# Altium schematic sheet PicoPrint-Motors.SchDoc
size A2; DocumentNumber: 4; SheetNumber: 4; SheetTotal: 5
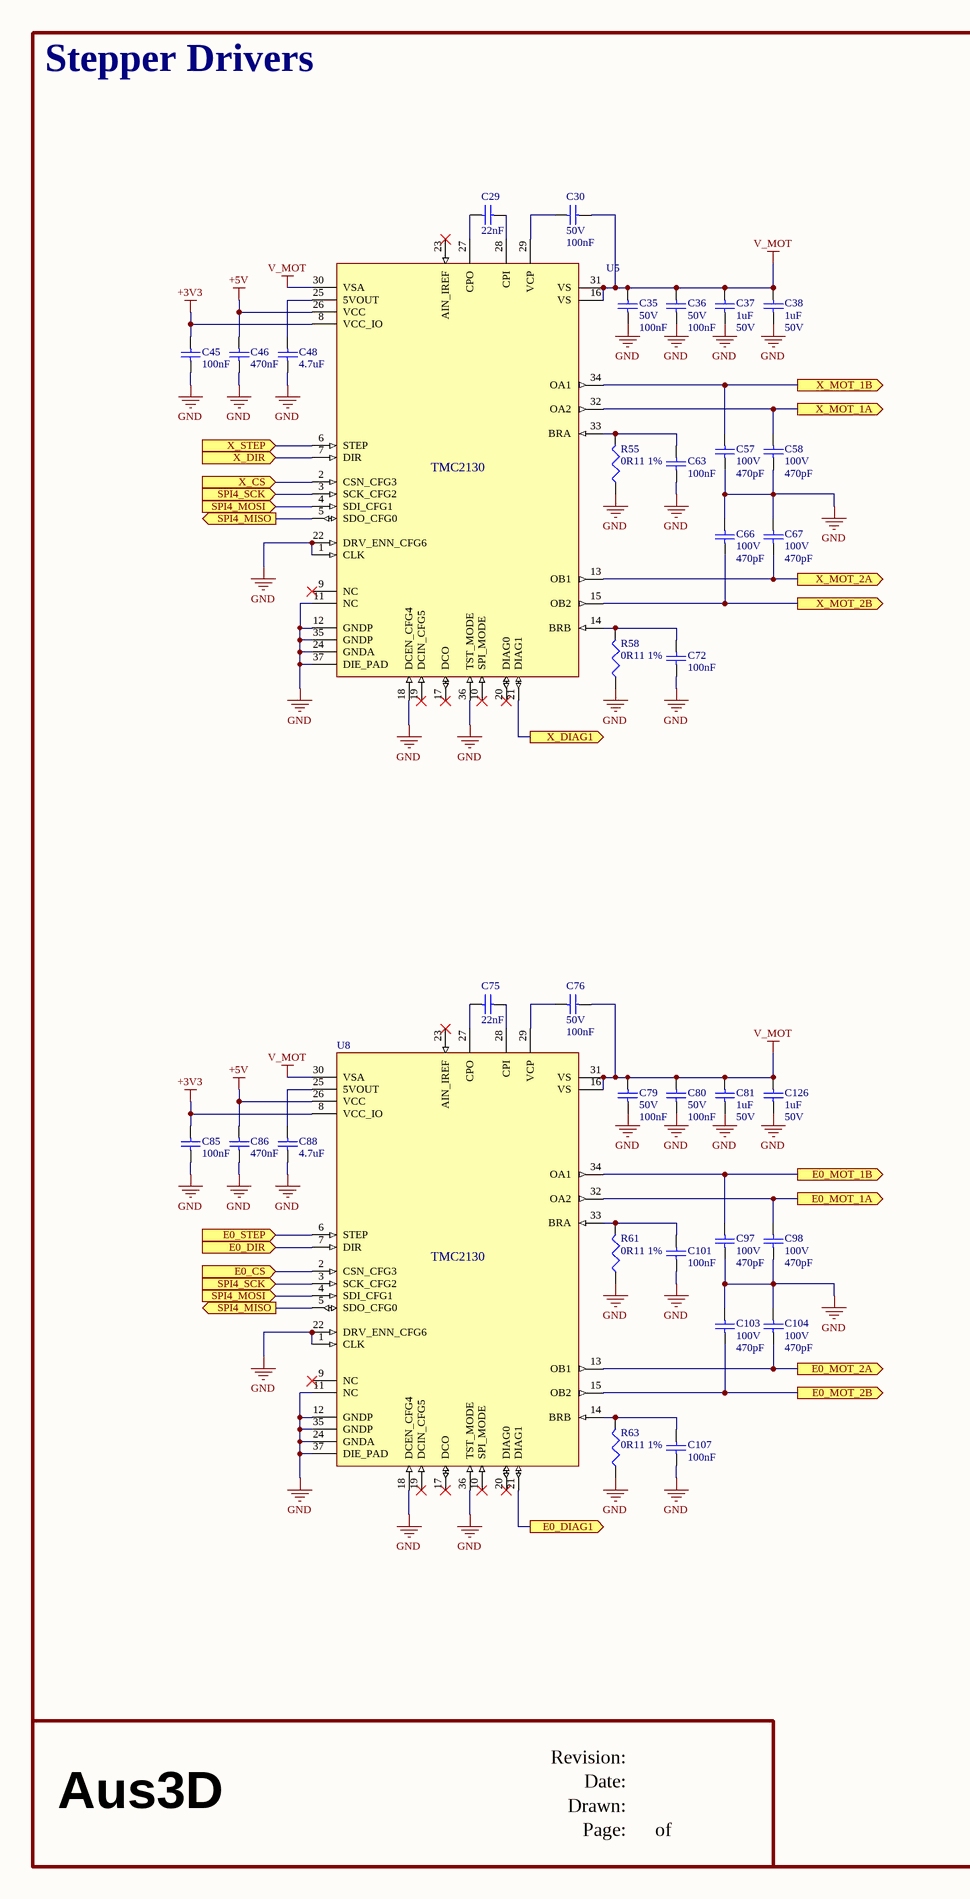
[diagram p0: PicoPrint-Motors.SchDoc, left]
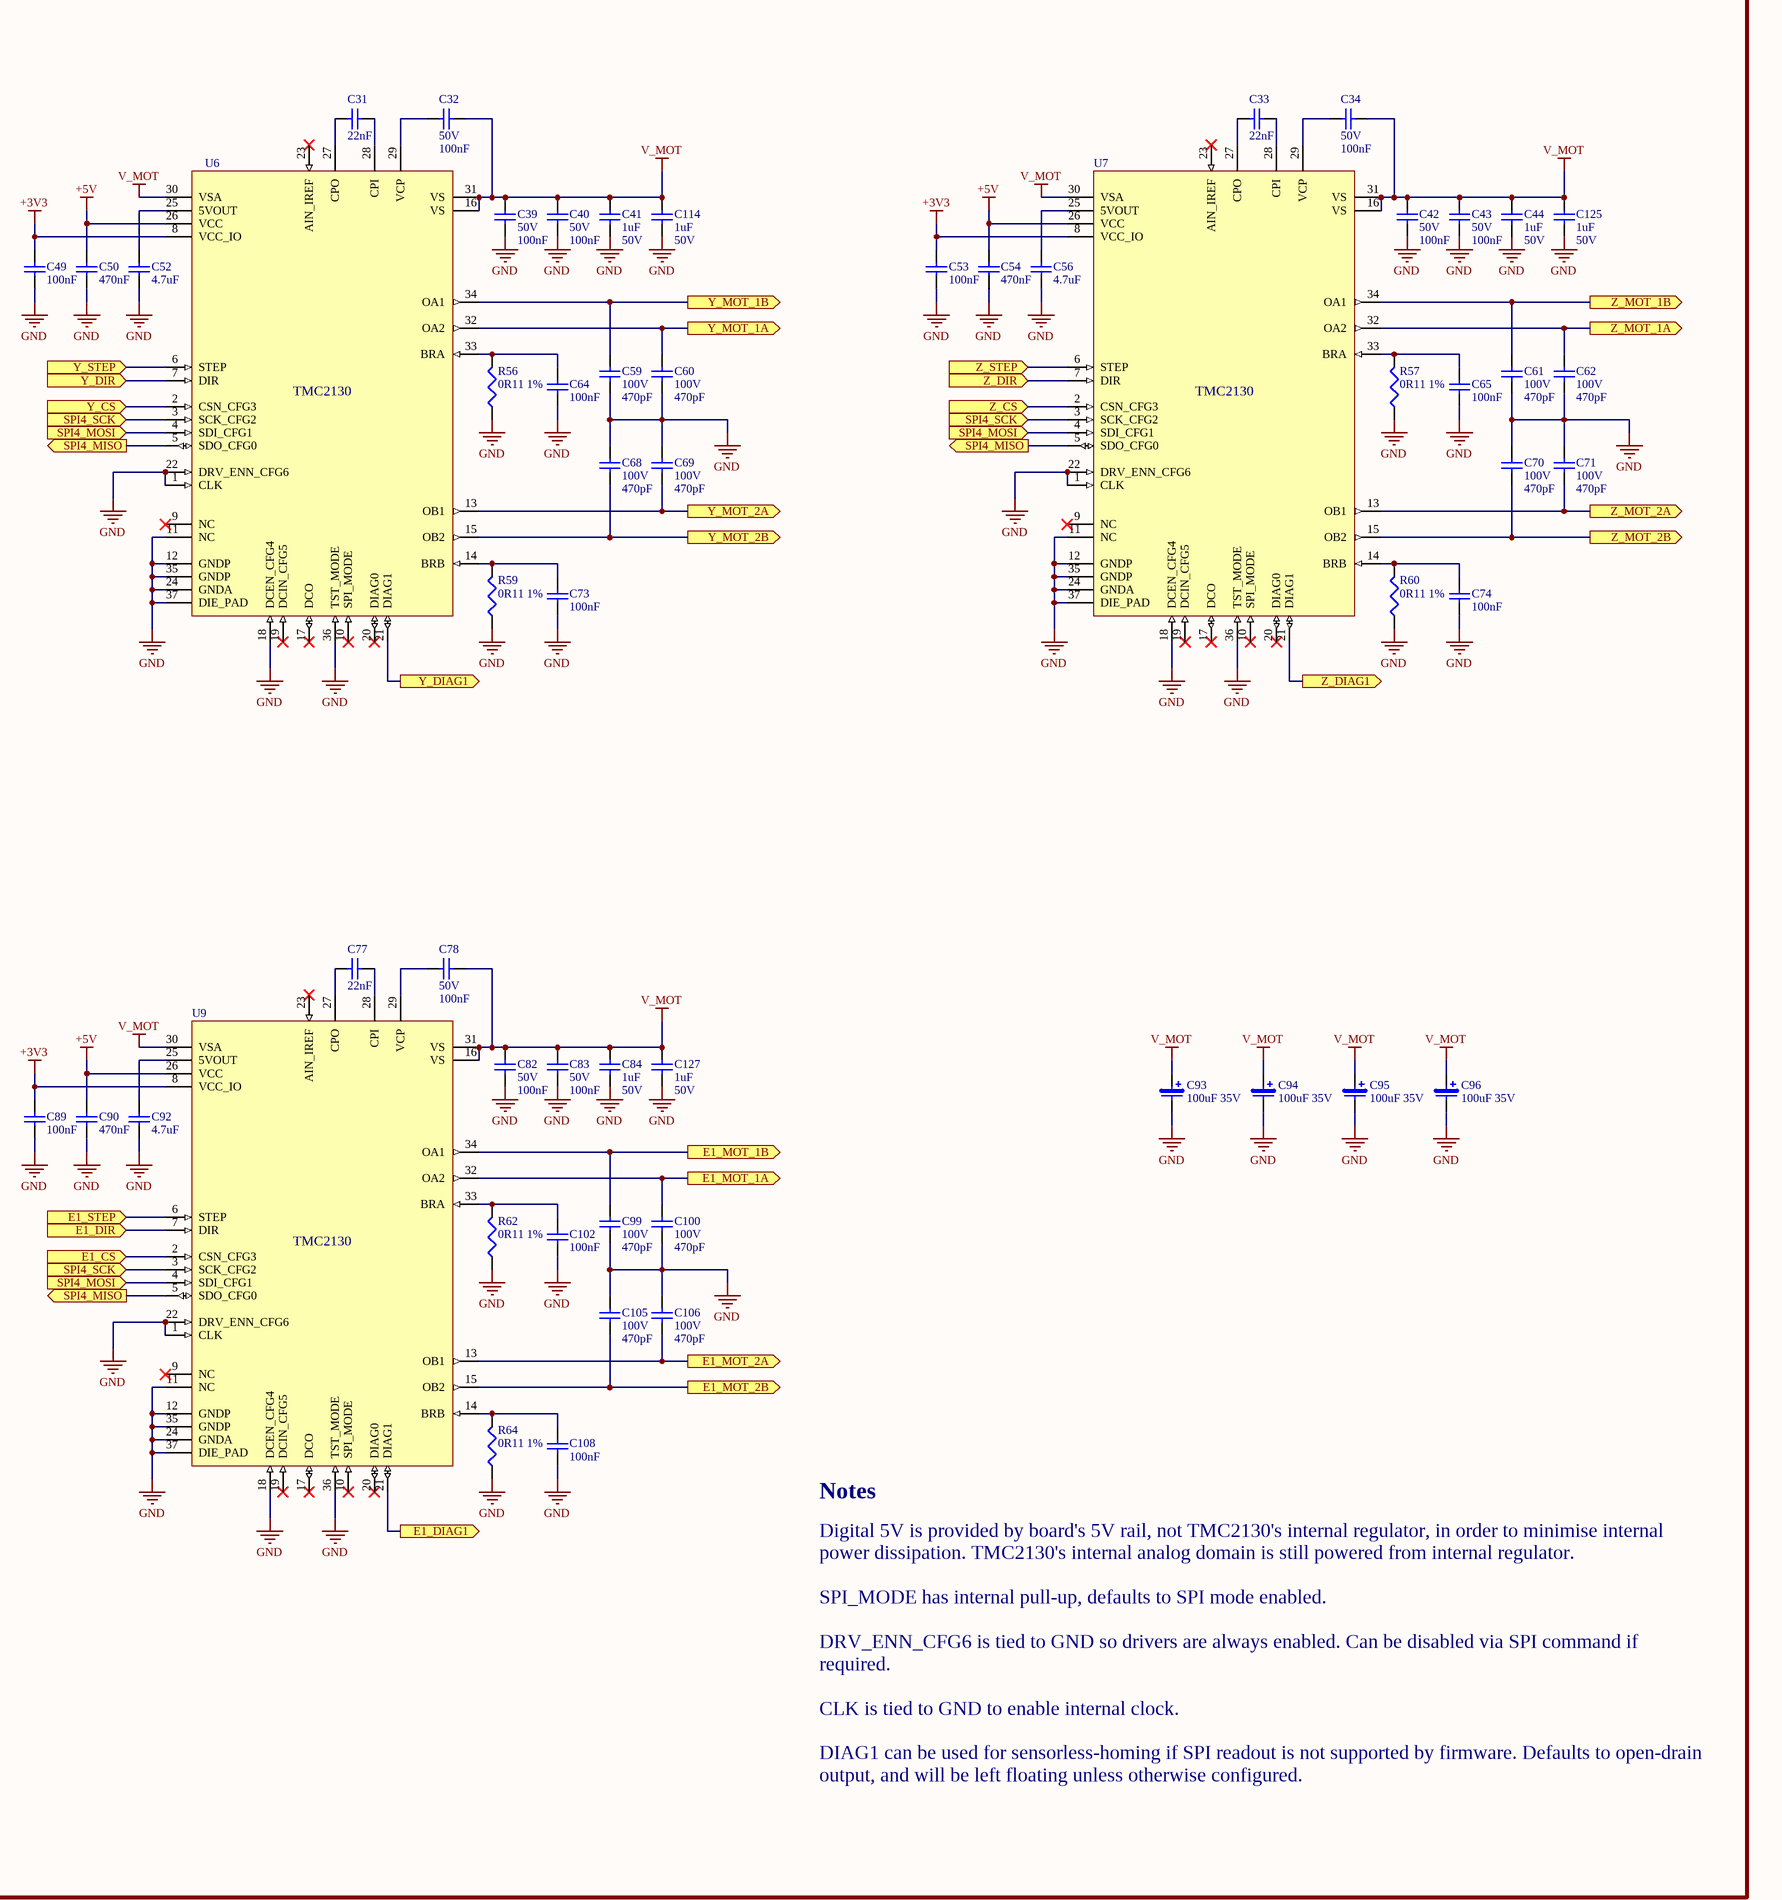
[diagram p1: PicoPrint-Motors.SchDoc, right]

## Parts
C29  value 22nF  [CAP 1005-0402]  (hidden comment: CapC-0402-22nF-50V)
C30  value 100nF  Voltage: 50V  [CAP 1005-0402]  (hidden comment: CapC-0402-100nF-50V)
C31  value 22nF  [CAP 1005-0402]  (hidden comment: CapC-0402-22nF-50V)
C32  value 100nF  Voltage: 50V  [CAP 1005-0402]  (hidden comment: CapC-0402-100nF-50V)
C33  value 22nF  [CAP 1005-0402]  (hidden comment: CapC-0402-22nF-50V)
C34  value 100nF  Voltage: 50V  [CAP 1005-0402]  (hidden comment: CapC-0402-100nF-50V)
C35  value 100nF  Voltage: 50V  [CAP 1005-0402]  (hidden comment: CapC-0402-100nF-50V)
C36  value 100nF  Voltage: 50V  [CAP 1005-0402]  (hidden comment: CapC-0402-100nF-50V)
C37  value 1uF  Voltage: 50V  [Cap 1608-0603]  (hidden comment: CapC-0603-1uF 50V)
C38  value 1uF  Voltage: 50V  [Cap 1608-0603]  (hidden comment: CapC-0603-1uF 50V)
C39  value 100nF  Voltage: 50V  [CAP 1005-0402]  (hidden comment: CapC-0402-100nF-50V)
C40  value 100nF  Voltage: 50V  [CAP 1005-0402]  (hidden comment: CapC-0402-100nF-50V)
C41  value 1uF  Voltage: 50V  [Cap 1608-0603]  (hidden comment: CapC-0603-1uF 50V)
C42  value 100nF  Voltage: 50V  [CAP 1005-0402]  (hidden comment: CapC-0402-100nF-50V)
C43  value 100nF  Voltage: 50V  [CAP 1005-0402]  (hidden comment: CapC-0402-100nF-50V)
C44  value 1uF  Voltage: 50V  [Cap 1608-0603]  (hidden comment: CapC-0603-1uF 50V)
C45  value 100nF  [CAP 1005-0402]  (hidden comment: CapC-0402-100nF)
C46  value 470nF  [CAP 1005-0402]  (hidden comment: CapC-0402-470nF)
C48  value 4.7uF  [CAP 1005-0402]  (hidden comment: CapC-0402-4.7uF-10V)
C49  value 100nF  [CAP 1005-0402]  (hidden comment: CapC-0402-100nF)
C50  value 470nF  [CAP 1005-0402]  (hidden comment: CapC-0402-470nF)
C52  value 4.7uF  [CAP 1005-0402]  (hidden comment: CapC-0402-4.7uF-10V)
C53  value 100nF  [CAP 1005-0402]  (hidden comment: CapC-0402-100nF)
C54  value 470nF  [CAP 1005-0402]  (hidden comment: CapC-0402-470nF)
C56  value 4.7uF  [CAP 1005-0402]  (hidden comment: CapC-0402-4.7uF-10V)
C57  value 470pF  Voltage: 100V  [CAP 1005-0402]  (hidden comment: CapC-0402-470pF-100V)
C58  value 470pF  Voltage: 100V  [CAP 1005-0402]  (hidden comment: CapC-0402-470pF-100V)
C59  value 470pF  Voltage: 100V  [CAP 1005-0402]  (hidden comment: CapC-0402-470pF-100V)
C60  value 470pF  Voltage: 100V  [CAP 1005-0402]  (hidden comment: CapC-0402-470pF-100V)
C61  value 470pF  Voltage: 100V  [CAP 1005-0402]  (hidden comment: CapC-0402-470pF-100V)
C62  value 470pF  Voltage: 100V  [CAP 1005-0402]  (hidden comment: CapC-0402-470pF-100V)
C63  value 100nF  [CAP 1005-0402]  (hidden comment: CapC-0402-100nF)
C64  value 100nF  [CAP 1005-0402]  (hidden comment: CapC-0402-100nF)
C65  value 100nF  [CAP 1005-0402]  (hidden comment: CapC-0402-100nF)
C66  value 470pF  Voltage: 100V  [CAP 1005-0402]  (hidden comment: CapC-0402-470pF-100V)
C67  value 470pF  Voltage: 100V  [CAP 1005-0402]  (hidden comment: CapC-0402-470pF-100V)
C68  value 470pF  Voltage: 100V  [CAP 1005-0402]  (hidden comment: CapC-0402-470pF-100V)
C69  value 470pF  Voltage: 100V  [CAP 1005-0402]  (hidden comment: CapC-0402-470pF-100V)
C70  value 470pF  Voltage: 100V  [CAP 1005-0402]  (hidden comment: CapC-0402-470pF-100V)
C71  value 470pF  Voltage: 100V  [CAP 1005-0402]  (hidden comment: CapC-0402-470pF-100V)
C72  value 100nF  [CAP 1005-0402]  (hidden comment: CapC-0402-100nF)
C73  value 100nF  [CAP 1005-0402]  (hidden comment: CapC-0402-100nF)
C74  value 100nF  [CAP 1005-0402]  (hidden comment: CapC-0402-100nF)
C75  value 22nF  [CAP 1005-0402]  (hidden comment: CapC-0402-22nF-50V)
C76  value 100nF  Voltage: 50V  [CAP 1005-0402]  (hidden comment: CapC-0402-100nF-50V)
C77  value 22nF  [CAP 1005-0402]  (hidden comment: CapC-0402-22nF-50V)
C78  value 100nF  Voltage: 50V  [CAP 1005-0402]  (hidden comment: CapC-0402-100nF-50V)
C79  value 100nF  Voltage: 50V  [CAP 1005-0402]  (hidden comment: CapC-0402-100nF-50V)
C80  value 100nF  Voltage: 50V  [CAP 1005-0402]  (hidden comment: CapC-0402-100nF-50V)
C81  value 1uF  Voltage: 50V  [Cap 1608-0603]  (hidden comment: CapC-0603-1uF 50V)
C82  value 100nF  Voltage: 50V  [CAP 1005-0402]  (hidden comment: CapC-0402-100nF-50V)
C83  value 100nF  Voltage: 50V  [CAP 1005-0402]  (hidden comment: CapC-0402-100nF-50V)
C84  value 1uF  Voltage: 50V  [Cap 1608-0603]  (hidden comment: CapC-0603-1uF 50V)
C85  value 100nF  [CAP 1005-0402]  (hidden comment: CapC-0402-100nF)
C86  value 470nF  [CAP 1005-0402]  (hidden comment: CapC-0402-470nF)
C88  value 4.7uF  [CAP 1005-0402]  (hidden comment: CapC-0402-4.7uF-10V)
C89  value 100nF  [CAP 1005-0402]  (hidden comment: CapC-0402-100nF)
C90  value 470nF  [CAP 1005-0402]  (hidden comment: CapC-0402-470nF)
C92  value 4.7uF  [CAP 1005-0402]  (hidden comment: CapC-0402-4.7uF-10V)
C93  value 100uF 35V  [CAP EL PANASONIC]  (hidden comment: CapE-6.3-100uF-35V)
C94  value 100uF 35V  [CAP EL PANASONIC]  (hidden comment: CapE-6.3-100uF-35V)
C95  value 100uF 35V  [CAP EL PANASONIC]  (hidden comment: CapE-6.3-100uF-35V)
C96  value 100uF 35V  [CAP EL PANASONIC]  (hidden comment: CapE-6.3-100uF-35V)
C97  value 470pF  Voltage: 100V  [CAP 1005-0402]  (hidden comment: CapC-0402-470pF-100V)
C98  value 470pF  Voltage: 100V  [CAP 1005-0402]  (hidden comment: CapC-0402-470pF-100V)
C99  value 470pF  Voltage: 100V  [CAP 1005-0402]  (hidden comment: CapC-0402-470pF-100V)
C100  value 470pF  Voltage: 100V  [CAP 1005-0402]  (hidden comment: CapC-0402-470pF-100V)
C101  value 100nF  [CAP 1005-0402]  (hidden comment: CapC-0402-100nF)
C102  value 100nF  [CAP 1005-0402]  (hidden comment: CapC-0402-100nF)
C103  value 470pF  Voltage: 100V  [CAP 1005-0402]  (hidden comment: CapC-0402-470pF-100V)
C104  value 470pF  Voltage: 100V  [CAP 1005-0402]  (hidden comment: CapC-0402-470pF-100V)
C105  value 470pF  Voltage: 100V  [CAP 1005-0402]  (hidden comment: CapC-0402-470pF-100V)
C106  value 470pF  Voltage: 100V  [CAP 1005-0402]  (hidden comment: CapC-0402-470pF-100V)
C107  value 100nF  [CAP 1005-0402]  (hidden comment: CapC-0402-100nF)
C108  value 100nF  [CAP 1005-0402]  (hidden comment: CapC-0402-100nF)
C114  value 1uF  Voltage: 50V  [Cap 1608-0603]  (hidden comment: CapC-0603-1uF 50V)
C125  value 1uF  Voltage: 50V  [Cap 1608-0603]  (hidden comment: CapC-0603-1uF 50V)
C126  value 1uF  Voltage: 50V  [Cap 1608-0603]  (hidden comment: CapC-0603-1uF 50V)
C127  value 1uF  Voltage: 50V  [Cap 1608-0603]  (hidden comment: CapC-0603-1uF 50V)
R55  value 0R11 1%  [Res 2012-0805]  (hidden comment: Res-0805-0R11-0.333W)
R56  value 0R11 1%  [Res 2012-0805]  (hidden comment: Res-0805-0R11-0.333W)
R57  value 0R11 1%  [Res 2012-0805]  (hidden comment: Res-0805-0R11-0.333W)
R58  value 0R11 1%  [Res 2012-0805]  (hidden comment: Res-0805-0R11-0.333W)
R59  value 0R11 1%  [Res 2012-0805]  (hidden comment: Res-0805-0R11-0.333W)
R60  value 0R11 1%  [Res 2012-0805]  (hidden comment: Res-0805-0R11-0.333W)
R61  value 0R11 1%  [Res 2012-0805]  (hidden comment: Res-0805-0R11-0.333W)
R62  value 0R11 1%  [Res 2012-0805]  (hidden comment: Res-0805-0R11-0.333W)
R63  value 0R11 1%  [Res 2012-0805]  (hidden comment: Res-0805-0R11-0.333W)
R64  value 0R11 1%  [Res 2012-0805]  (hidden comment: Res-0805-0R11-0.333W)
U5  TMC2130-LA  [QFN50P500X600X90_HS-37N]  (value not drawn)
U6  TMC2130-LA  [QFN50P500X600X90_HS-37N]  (value not drawn)
U7  TMC2130-LA  [QFN50P500X600X90_HS-37N]  (value not drawn)
U8  TMC2130-LA  [QFN50P500X600X90_HS-37N]  (value not drawn)
U9  TMC2130-LA  [QFN50P500X600X90_HS-37N]  (value not drawn)

## Ports
E0_CS (in), E0_DIAG1 (out), E0_DIR (in), E0_MOT_1A (out), E0_MOT_1B (out), E0_MOT_2A (out), E0_MOT_2B (out), E0_STEP (in), E1_CS (in), E1_DIAG1 (out), E1_DIR (in), E1_MOT_1A (out), E1_MOT_1B (out), E1_MOT_2A (out), E1_MOT_2B (out), E1_STEP (in), SPI4_MISO (out), SPI4_MOSI (in), SPI4_SCK (in), X_CS (in), X_DIAG1 (out), X_DIR (in), X_MOT_1A (out), X_MOT_1B (out), X_MOT_2A (out), X_MOT_2B (out), X_STEP (in), Y_CS (in), Y_DIAG1 (out), Y_DIR (in), Y_MOT_1A (out), Y_MOT_1B (out), Y_MOT_2A (out), Y_MOT_2B (out), Y_STEP (in), Z_CS (in), Z_DIAG1 (out), Z_DIR (in), Z_MOT_1A (out), Z_MOT_1B (out), Z_MOT_2A (out), Z_MOT_2B (out), Z_STEP (in)

## Nets
+3V3: C45.2 C49.2 C53.2 C85.2 C89.2 U5.8(VCC_IO) U6.8(VCC_IO) U7.8(VCC_IO) U8.8(VCC_IO) U9.8(VCC_IO)
+5V: C46.2 C50.2 C54.2 C86.2 C90.2 U5.26(VCC) U6.26(VCC) U7.26(VCC) U8.26(VCC) U9.26(VCC)
GND: C35.2 C36.2 C37.1 C38.1 C39.2 C40.2 C41.1 C42.2 C43.2 C44.1 C45.1 C46.1 C48.1 C49.1 C50.1 C52.1 C53.1 C54.1 C56.1 C57.1 C58.1 C59.1 C60.1 C61.1 C62.1 C63.2 C64.2 C65.2 C66.2 C67.2 C68.2 C69.2 C70.2 C71.2 C72.2 C73.2 C74.2 C79.2 C80.2 C81.1 C82.2 C83.2 C84.1 C85.1 C86.1 C88.1 C89.1 C90.1 C92.1 C93.2 C94.2 C95.2 C96.2 C97.1 C98.1 C99.1 C100.1 C101.2 C102.2 C103.2 C104.2 C105.2 C106.2 C107.2 C108.2 C114.1 C125.1 C126.1 C127.1 R55.1 R56.1 R57.1 R58.1 R59.1 R60.1 R61.1 R62.1 R63.1 R64.1 U5.1(CLK) U5.11(NC) U5.12(GNDP) U5.18(DCEN_CFG4) U5.22(DRV_ENN_CFG6) U5.24(GNDA) U5.35(GNDP) U5.36(TST_MODE) U5.37(DIE_PAD) U6.1(CLK) U6.11(NC) U6.12(GNDP) U6.18(DCEN_CFG4) U6.22(DRV_ENN_CFG6) U6.24(GNDA) U6.35(GNDP) U6.36(TST_MODE) U6.37(DIE_PAD) U7.1(CLK) U7.11(NC) U7.12(GNDP) U7.18(DCEN_CFG4) U7.22(DRV_ENN_CFG6) U7.24(GNDA) U7.35(GNDP) U7.36(TST_MODE) U7.37(DIE_PAD) U8.1(CLK) U8.11(NC) U8.12(GNDP) U8.18(DCEN_CFG4) U8.22(DRV_ENN_CFG6) U8.24(GNDA) U8.35(GNDP) U8.36(TST_MODE) U8.37(DIE_PAD) U9.1(CLK) U9.11(NC) U9.12(GNDP) U9.18(DCEN_CFG4) U9.22(DRV_ENN_CFG6) U9.24(GNDA) U9.35(GNDP) U9.36(TST_MODE) U9.37(DIE_PAD)
V_MOT: C30.1 C32.1 C34.1 C35.1 C36.1 C37.2 C38.2 C39.1 C40.1 C41.2 C42.1 C43.1 C44.2 C76.1 C78.1 C79.1 C80.1 C81.2 C82.1 C83.1 C84.2 C93.1 C94.1 C95.1 C96.1 C114.2 C125.2 C126.2 C127.2 U5.16(VS) U5.30(VSA) U5.31(VS) U6.16(VS) U6.30(VSA) U6.31(VS) U7.16(VS) U7.30(VSA) U7.31(VS) U8.16(VS) U8.30(VSA) U8.31(VS) U9.16(VS) U9.30(VSA) U9.31(VS)
E0_CS: U8.2(CSN_CFG3) ; port E0_CS
E0_DIAG1: U8.21(DIAG1) ; port E0_DIAG1
E0_DIR: U8.7(DIR) ; port E0_DIR
E0_MOT_1A: C98.2 U8.32(OA2) ; port E0_MOT_1A
E0_MOT_1B: C97.2 U8.34(OA1) ; port E0_MOT_1B
E0_MOT_2A: C104.1 U8.13(OB1) ; port E0_MOT_2A
E0_MOT_2B: C103.1 U8.15(OB2) ; port E0_MOT_2B
E0_STEP: U8.6(STEP) ; port E0_STEP
E1_CS: U9.2(CSN_CFG3) ; port E1_CS
E1_DIAG1: U9.21(DIAG1) ; port E1_DIAG1
E1_DIR: U9.7(DIR) ; port E1_DIR
E1_MOT_1A: C100.2 U9.32(OA2) ; port E1_MOT_1A
E1_MOT_1B: C99.2 U9.34(OA1) ; port E1_MOT_1B
E1_MOT_2A: C106.1 U9.13(OB1) ; port E1_MOT_2A
E1_MOT_2B: C105.1 U9.15(OB2) ; port E1_MOT_2B
E1_STEP: U9.6(STEP) ; port E1_STEP
SPI4_MISO: U5.5(SDO_CFG0) U6.5(SDO_CFG0) U7.5(SDO_CFG0) U8.5(SDO_CFG0) U9.5(SDO_CFG0) ; port SPI4_MISO
SPI4_MOSI: U5.4(SDI_CFG1) U6.4(SDI_CFG1) U7.4(SDI_CFG1) U8.4(SDI_CFG1) U9.4(SDI_CFG1) ; port SPI4_MOSI
SPI4_SCK: U5.3(SCK_CFG2) U6.3(SCK_CFG2) U7.3(SCK_CFG2) U8.3(SCK_CFG2) U9.3(SCK_CFG2) ; port SPI4_SCK
X_CS: U5.2(CSN_CFG3) ; port X_CS
X_DIAG1: U5.21(DIAG1) ; port X_DIAG1
X_DIR: U5.7(DIR) ; port X_DIR
X_MOT_1A: C58.2 U5.32(OA2) ; port X_MOT_1A
X_MOT_1B: C57.2 U5.34(OA1) ; port X_MOT_1B
X_MOT_2A: C67.1 U5.13(OB1) ; port X_MOT_2A
X_MOT_2B: C66.1 U5.15(OB2) ; port X_MOT_2B
X_STEP: U5.6(STEP) ; port X_STEP
Y_CS: U6.2(CSN_CFG3) ; port Y_CS
Y_DIAG1: U6.21(DIAG1) ; port Y_DIAG1
Y_DIR: U6.7(DIR) ; port Y_DIR
Y_MOT_1A: C60.2 U6.32(OA2) ; port Y_MOT_1A
Y_MOT_1B: C59.2 U6.34(OA1) ; port Y_MOT_1B
Y_MOT_2A: C69.1 U6.13(OB1) ; port Y_MOT_2A
Y_MOT_2B: C68.1 U6.15(OB2) ; port Y_MOT_2B
Y_STEP: U6.6(STEP) ; port Y_STEP
Z_CS: U7.2(CSN_CFG3) ; port Z_CS
Z_DIAG1: U7.21(DIAG1) ; port Z_DIAG1
Z_DIR: U7.7(DIR) ; port Z_DIR
Z_MOT_1A: C62.2 U7.32(OA2) ; port Z_MOT_1A
Z_MOT_1B: C61.2 U7.34(OA1) ; port Z_MOT_1B
Z_MOT_2A: C71.1 U7.13(OB1) ; port Z_MOT_2A
Z_MOT_2B: C70.1 U7.15(OB2) ; port Z_MOT_2B
Z_STEP: U7.6(STEP) ; port Z_STEP
NetC29_1: C29.1 U5.27(CPO)
NetC29_2: C29.2 U5.28(CPI)
NetC30_2: C30.2 U5.29(VCP)
NetC31_1: C31.1 U6.27(CPO)
NetC31_2: C31.2 U6.28(CPI)
NetC32_2: C32.2 U6.29(VCP)
NetC33_1: C33.1 U7.27(CPO)
NetC33_2: C33.2 U7.28(CPI)
NetC34_2: C34.2 U7.29(VCP)
NetC48_2: C48.2 U5.25(5VOUT)
NetC52_2: C52.2 U6.25(5VOUT)
NetC56_2: C56.2 U7.25(5VOUT)
NetC63_1: C63.1 R55.2 U5.33(BRA)
NetC64_1: C64.1 R56.2 U6.33(BRA)
NetC65_1: C65.1 R57.2 U7.33(BRA)
NetC72_1: C72.1 R58.2 U5.14(BRB)
NetC73_1: C73.1 R59.2 U6.14(BRB)
NetC74_1: C74.1 R60.2 U7.14(BRB)
NetC75_1: C75.1 U8.27(CPO)
NetC75_2: C75.2 U8.28(CPI)
NetC76_2: C76.2 U8.29(VCP)
NetC77_1: C77.1 U9.27(CPO)
NetC77_2: C77.2 U9.28(CPI)
NetC78_2: C78.2 U9.29(VCP)
NetC88_2: C88.2 U8.25(5VOUT)
NetC92_2: C92.2 U9.25(5VOUT)
NetC101_1: C101.1 R61.2 U8.33(BRA)
NetC102_1: C102.1 R62.2 U9.33(BRA)
NetC107_1: C107.1 R63.2 U8.14(BRB)
NetC108_1: C108.1 R64.2 U9.14(BRB)

Not connected (* = marked no-connect by the designer): U5 9(NC)* 10(SPI_MODE)* 17(DCO)* 19(DCIN_CFG5)* 20(DIAG0)* 23(AIN_IREF)*; U6 9(NC)* 10(SPI_MODE)* 17(DCO)* 19(DCIN_CFG5)* 20(DIAG0)* 23(AIN_IREF)*; U7 9(NC)* 10(SPI_MODE)* 17(DCO)* 19(DCIN_CFG5)* 20(DIAG0)* 23(AIN_IREF)*; U8 9(NC)* 10(SPI_MODE)* 17(DCO)* 19(DCIN_CFG5)* 20(DIAG0)* 23(AIN_IREF)*; U9 9(NC)* 10(SPI_MODE)* 17(DCO)* 19(DCIN_CFG5)* 20(DIAG0)* 23(AIN_IREF)*

## Notes on the sheet
- Stepper Drivers
- Notes
- Date:
- Revision:
- Digital 5V is provided by board's 5V rail, not TMC2130's internal regulator, in order to minimise internal power dissipation. TMC2130's internal analog domain is still powered from internal regulator.
  SPI_MODE has internal pull-up, defaults to SPI mode enabled.
  DRV_ENN_CFG6 is tied to GND so drivers are always enabled. Can be disabled via SPI command if required.
  CLK is tied to GND to enable internal clock.
  DIAG1 can be used for sensorless-homing if SPI readout is not supported by firmware. Defaults to open-drain output, and will be left floating unless otherwise configured.
- Aus3D
- Drawn:
- Page:
- of
- (in symbol TMC2130_LA) TMC2130

## Library data of the parts
C29 C31 C33 C75 C77 = CapC-0402-22nF-50V: Capacitor (SMD Ceramic); Voltage: 50V; Note: Approved sub OK; Published: 8-Jun-2000; Revision: July-2002: Re-released for DXP Platform.; Publisher: Altium Limited; Supplier 1: Digi-Key; Supplier Part Number 1: 490-3884-1-ND
C30 C32 C34-C36 C39 C40 C42 C43 C76 C78-C80 C82 C83 = CapC-0402-100nF-50V: Capacitor (SMD Ceramic); Note: Approved sub OK; Published: 8-Jun-2000; Revision: July-2002: Re-released for DXP Platform.; Publisher: Altium Limited; Supplier 1: Digi-Key; Supplier Part Number 1: 490-10700-1-ND
C37 C38 C41 C44 C81 C84 C114 C125-C127 = CapC-0603-1uF 50V: Capacitor (SMD Ceramic); Note: Approved sub OK; Published: 8-Jun-2000; Revision: July-2002: Re-released for DXP Platform.; Publisher: Altium Limited; Supplier 1: Digi-Key; Supplier Part Number 1: 1276-1860-1-ND
C45 C49 C53 C63-C65 C72-C74 C85 C89 C101 C102 C107 C108 = CapC-0402-100nF: Capacitor (SMD Ceramic); Note: Approved sub OK; Published: 8-Jun-2000; Revision: July-2002: Re-released for DXP Platform.; Publisher: Altium Limited; Supplier 1: Digi-Key; Supplier Part Number 1: 311-1336-1-ND
C46 C50 C54 C86 C90 = CapC-0402-470nF: Capacitor (SMD Ceramic); Note: Approved sub OK; Published: 8-Jun-2000; Revision: July-2002: Re-released for DXP Platform.; Publisher: Altium Limited; Supplier 1: Digi-Key; Supplier Part Number 1: 1276-1173-1-ND
C48 C52 C56 C88 C92 = CapC-0402-4.7uF-10V: Capacitor (SMD Ceramic); Voltage: 10V; Note: Approved sub OK; Published: 8-Jun-2000; Revision: July-2002: Re-released for DXP Platform.; Publisher: Altium Limited; Supplier 1: Digi-Key; Supplier Part Number 1: 1276-1482-1-ND
C57-C62 C66-C71 C97-C100 C103-C106 = CapC-0402-470pF-100V: Capacitor (SMD Ceramic); Note: Approved sub OK; Published: 8-Jun-2000; Revision: July-2002: Re-released for DXP Platform.; Publisher: Altium Limited; Supplier 1: Digi-Key; Supplier Part Number 1: 490-6369-1-ND
C93-C96 = CapE-6.3-100uF-35V: Capacitor (SMD Polarised Electrolytic); Note: Approved sub OK; Published: 8-Jun-2000; Revision: July-2002: Re-released for DXP Platform.; Publisher: Altium Limited; Supplier 1: Digi-Key; Supplier Part Number 1: PCE5016CT-ND
R55-R64 = Res-0805-0R11: Resistor; Note: Approved sub OK; Published: 8-Jun-2000; Revision: July-2002: Re-released for DXP Platform.; Publisher: Altium Limited; Supplier 1: Digi-Key; Supplier Part Number 1: RL12S.11FCT-ND
U5-U9 = TMC2130_LA: Stepper Driver IC; Supplier 1: Digi-Key; Supplier Part Number 1: 1460-1130-1-ND